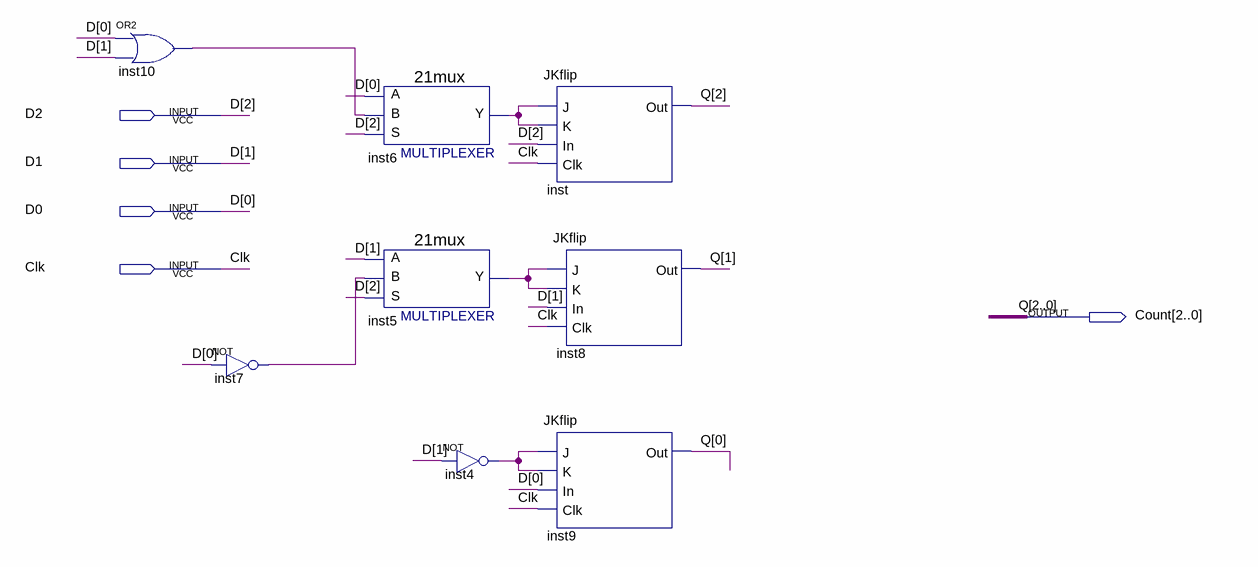
[diagram p0: schematic sheet]
// Quartus schematic Practice1.bdf as structural Verilog: 8 symbols, 5 pins
module Practice1 (
  input  D2,
  input  D1,
  input  D0,
  input  Clk,
  output [2:0] Count
);

  wire inst4_out, inst5_y, inst6_y, inst7_out, inst10_out;

  or inst10 (inst10_out, D0, D1);
  not inst7 (inst7_out, D0);
  \21mux  inst6 (.S(D2), .B(inst10_out), .A(D0), .Y(inst6_y));
  \21mux  inst5 (.S(D2), .B(inst7_out), .A(D1), .Y(inst5_y));
  not inst4 (inst4_out, D1);
  JKflip inst (.J(inst6_y), .K(inst6_y), .In(D2), .Clk(Clk), .Out(Count[2]));
  JKflip inst8 (.J(inst5_y), .K(inst5_y), .In(D1), .Clk(Clk), .Out(Count[1]));
  JKflip inst9 (.J(inst4_out), .K(inst4_out), .In(D0), .Clk(Clk), .Out(Count[0]));

  // Other names for the same wires on the sheet: Q[2:0] = Count
endmodule
